# EAGLE design antibounce (EAGLE 7.2.0)
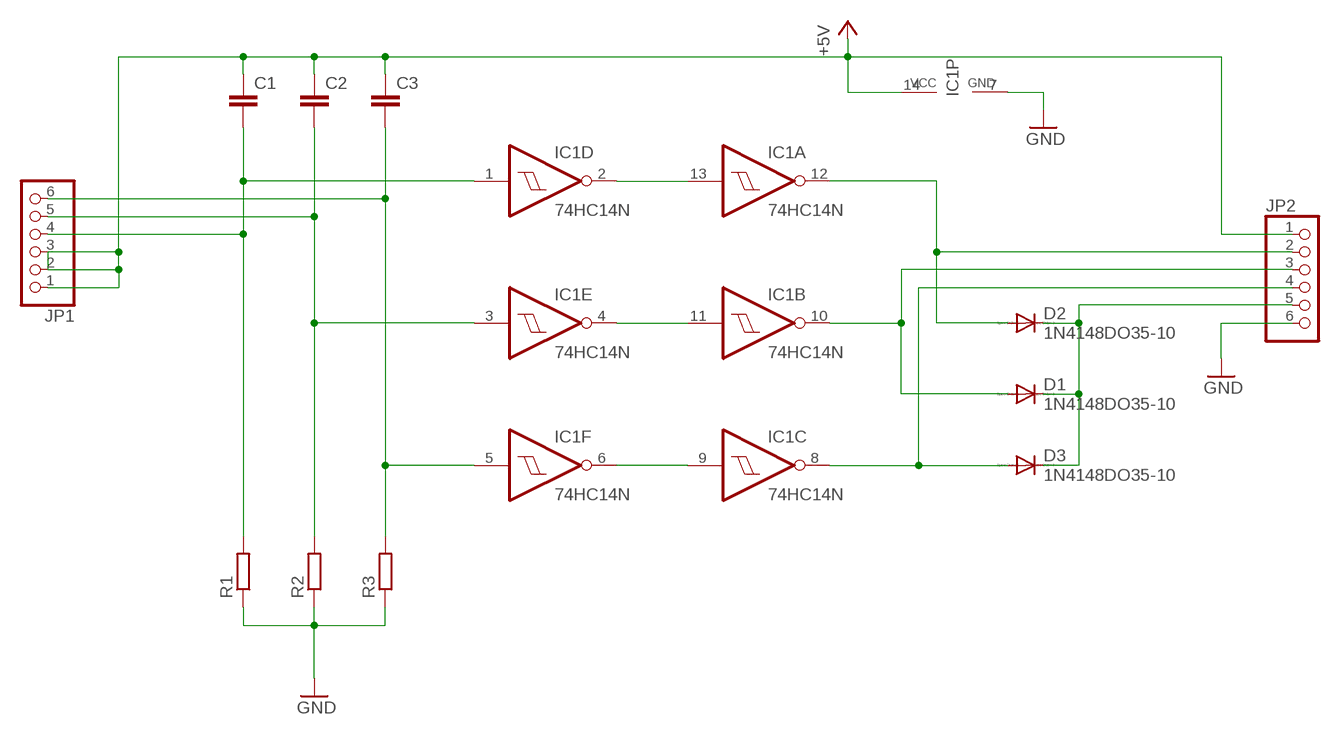
[diagram p0: schematic, sheet 1]

## Parts
C1  C-EU050-024X044  [C050-024X044]
C2  C-EU050-024X044  [C050-024X044]
C3  C-EU050-024X044  [C050-024X044]
D1  1N4148DO35-10  [DO35-10]
D2  1N4148DO35-10  [DO35-10]
D3  1N4148DO35-10  [DO35-10]
IC1  74HC14N  [DIL14]
JP1  PINHD-1X6  [1X06]
JP2  PINHD-1X6  [1X06]
R1  R-EU_0207/10  [0207/10]
R2  R-EU_0207/10  [0207/10]
R3  R-EU_0207/10  [0207/10]

## Nets
+5V: C1.1 C2.1 C3.1 IC1.14(P:VCC) JP1.1 JP1.2 JP1.3 JP2.1
GND: IC1.7(P:GND) JP2.6 R1.1 R2.1 R3.1
N$1: C1.2 IC1.1(D:I) JP1.4 R1.2
N$2: C2.2 IC1.3(E:I) JP1.5 R2.2
N$3: C3.2 IC1.5(F:I) JP1.6 R3.2
N$5: IC1.2(D:O) IC1.13(A:I)
N$6: IC1.6(F:O) IC1.9(C:I)
N$7: IC1.4(E:O) IC1.11(B:I)
N$8: D2.A IC1.12(A:O) JP2.2
N$9: D1.C D2.C D3.C JP2.5
N$10: D1.A IC1.10(B:O) JP2.3
N$11: D3.A IC1.8(C:O) JP2.4

## Library data of the parts
C1-C3 = rcl:C-EU: CAPACITOR, European symbol
D1-D3 = diode:1N4148: DIODE high speed (Philips)
IC1 = 74xx-eu:74*14: Hex schmitt trigger INVERTER
JP1 JP2 = pinhead:PINHD-1X6: PIN HEADER
R1-R3 = rcl:R-EU_: RESISTOR, European symbol

## Net classes
0 default: width 0.381 mm, clearance 0.381 mm

## Board
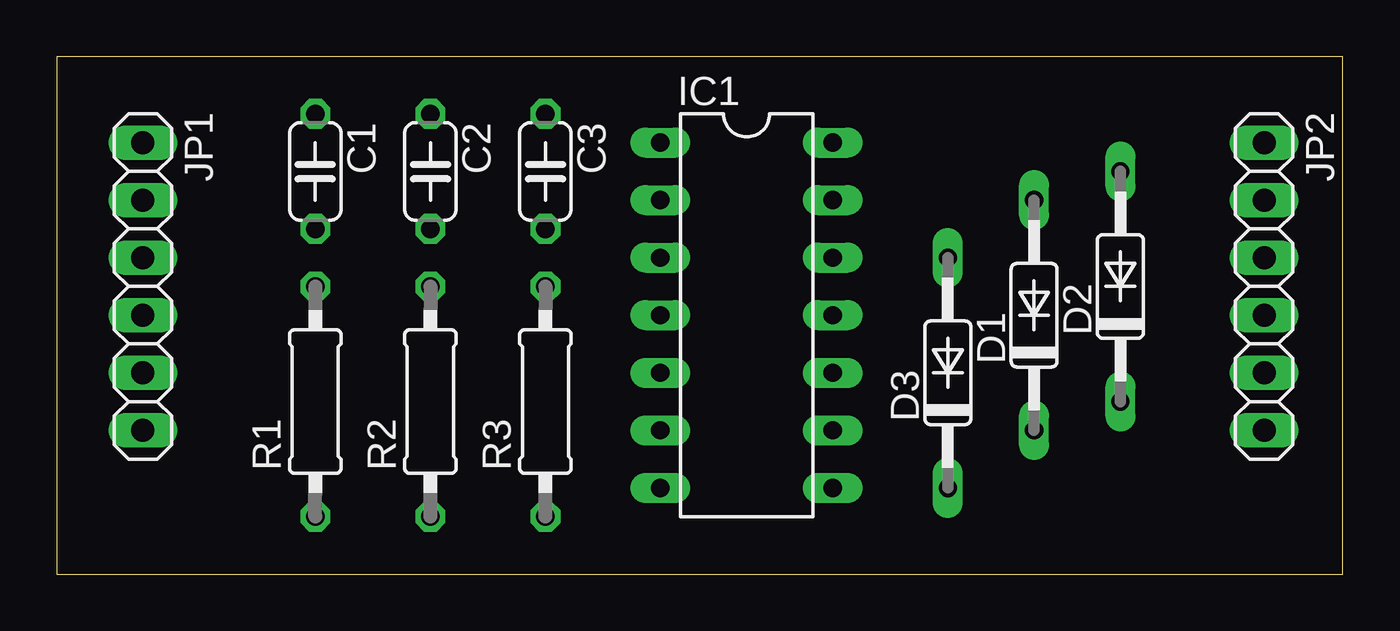
[diagram p1: board, top side]
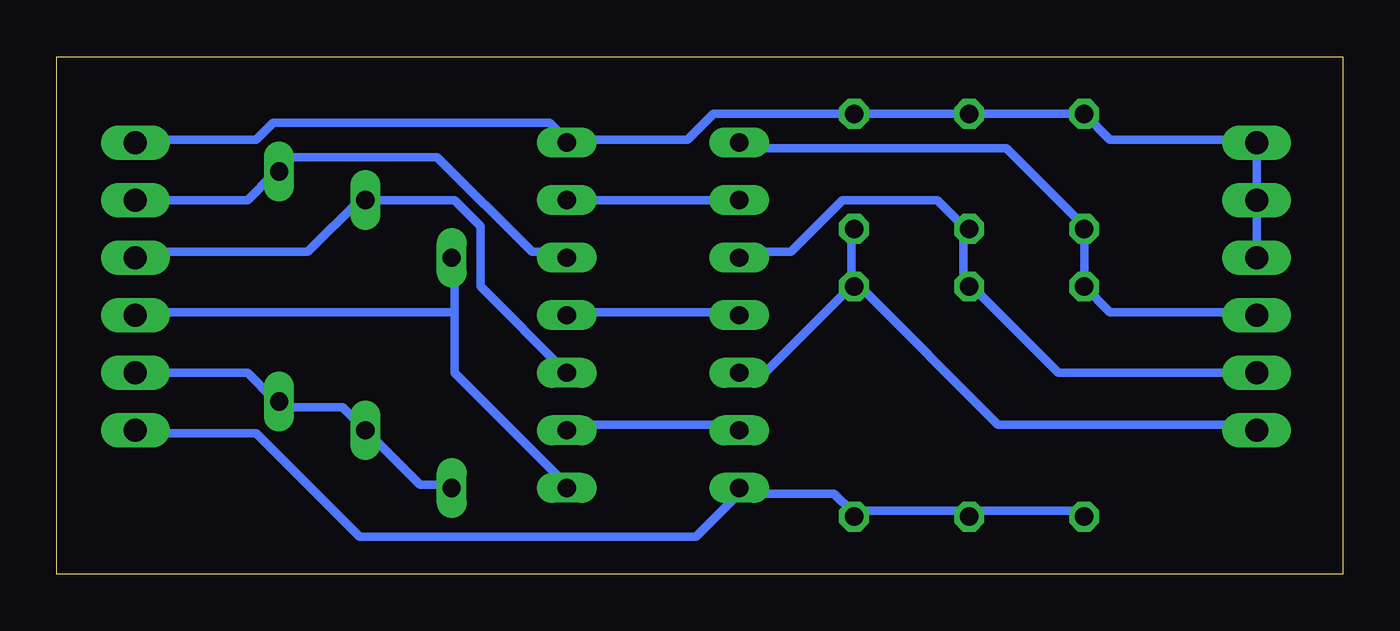
[diagram p2: board, bottom side, seen from below]

Size 56.82 x 22.85 mm. Coordinates in mm from the lower left corner, seen from the top.
Outline: 0,0 56.82,0 56.82,22.85 0,22.85 0,0
Copper layers (1*16): Top 0.035mm / dielectric 1.5mm / Bottom 0.035mm
Design rules "default": minimum track width 10mil, minimum drill 24mil, track to track 8mil, track to pad 8mil, pad to pad 8mil, via to via 8mil, smd to smd 8mil, copper to edge 40mil, drill to drill 8mil, minimum pad ring 10mil, minimum via ring 8mil, stop-mask expansion 4mil, vias tented up to drill 0mil, thermal gap 10mil

### Footprints (pad centres in the part's own frame; a part is rotated, then mirrored left to right if it is on the bottom)
C050-024X044 = drill 0.813 octagon: 1 -2.54,0; 2 2.54,0
DO35-10 = drill 0.813 long: A 5.08,0; C -5.08,0
DIL14 = drill 0.813 long: 1 -7.62,-3.81; 2 -5.08,-3.81; 3 -2.54,-3.81; 4 0,-3.81; 5 2.54,-3.81; 6 5.08,-3.81; 7 7.62,-3.81; 8 7.62,3.81; 9 5.08,3.81; 10 2.54,3.81; 11 0,3.81; 12 -2.54,3.81; 13 -5.08,3.81; 14 -7.62,3.81
1X06 = drill 1.016 long: 1 -6.35,0; 2 -3.81,0; 3 -1.27,0; 4 1.27,0; 5 3.81,0; 6 6.35,0
0207/10 = drill 0.813 octagon: 1 -5.08,0; 2 5.08,0

### Placement (x,y rotation side)
C1  11.43,17.78 270 top
C2  16.51,17.78 270 top
C3  21.59,17.78 270 top
D1  43.18,11.43 90 top
D2  46.99,12.7 90 top
D3  39.37,8.89 90 top
IC1  30.48,11.43 270 top
JP1  3.81,12.7 270 top
JP2  53.34,12.7 270 top
R1  11.43,7.62 90 top
R2  16.51,7.62 90 top
R3  21.59,7.62 90 top

### Tracks (layer width: path | path; a pad name or v marks a point on that pad's centre or on a via)
+5V
  Bottom 0.381: 34.29,19.18 28.96,19.18 27.81,20.32 C3.1 C2.1 C1.1 10.29,19.18 3.81,19.18 JP1.1 JP1.2 JP1.3 | 34.29,19.18 35.05,19.94 47.24,19.94 48.01,19.18 53.34,19.18 JP2.1 | 34.29,19.18 IC1.14
GND
  Bottom 0.381: R1.1 11.43,2.79 16.38,2.79 R2.1 16.76,2.79 21.34,2.79 R3.1 21.72,2.79 22.48,3.56 26.67,3.56 | 26.67,3.56 28.57,1.65 43.43,1.65 48.01,6.22 53.34,6.22 JP2.6 | 26.67,3.56 IC1.7
N$1
  Bottom 0.381: IC1.1 26.67,18.8 14.86,18.8 11.43,15.37 C1.2 R1.2 10.29,11.56 3.81,11.56 JP1.4
N$2
  Bottom 0.381: IC1.3 26.67,14.22 24.38,14.22 22.1,16.51 17.91,16.51 16.76,15.37 C2.2 16.76,14.99 16.76,12.7 R2.2 16.38,12.7 12.57,8.89 JP1.5
N$3
  Bottom 0.381: IC1.5 25.53,8.89 21.72,12.7 | 21.72,12.7 21.72,14.99 C3.2 | 21.72,12.7 R3.2 21.34,12.7 15.24,6.6 3.81,6.6 JP1.6
N$5
  Bottom 0.381: IC1.13 IC1.2
N$6
  Bottom 0.381: IC1.6 26.67,6.6 34.29,6.6 IC1.9
N$7
  Bottom 0.381: IC1.4 26.67,11.56 34.29,11.56 IC1.11
N$8
  Bottom 0.381: IC1.12 34.29,14.22 35.81,14.22 40,18.41 46.48,18.41 46.86,18.03 D2.A 47.24,17.65 48.39,16.51 JP2.2
N$9
  Bottom 0.381: D3.C 39.62,3.94 40.77,3.94 D1.C 44.2,7.37 46.86,7.37 D2.C 47.24,7.75 48.39,8.89 JP2.5
N$10
  Bottom 0.381: IC1.10 38.1,12.7 38.1,15.37 39.24,16.51 D1.A 43.43,16.51 45.72,14.22 53.34,14.22 JP2.3
N$11
  Bottom 0.381: 39.24,11.56 39.24,13.84 D3.A | 39.24,11.56 39.24,8.89 34.29,3.94 IC1.8 | 39.24,11.56 53.34,11.56 JP2.4